# Altium schematic sheet 0189_POWER METER -PAC19.SchDoc
size A3
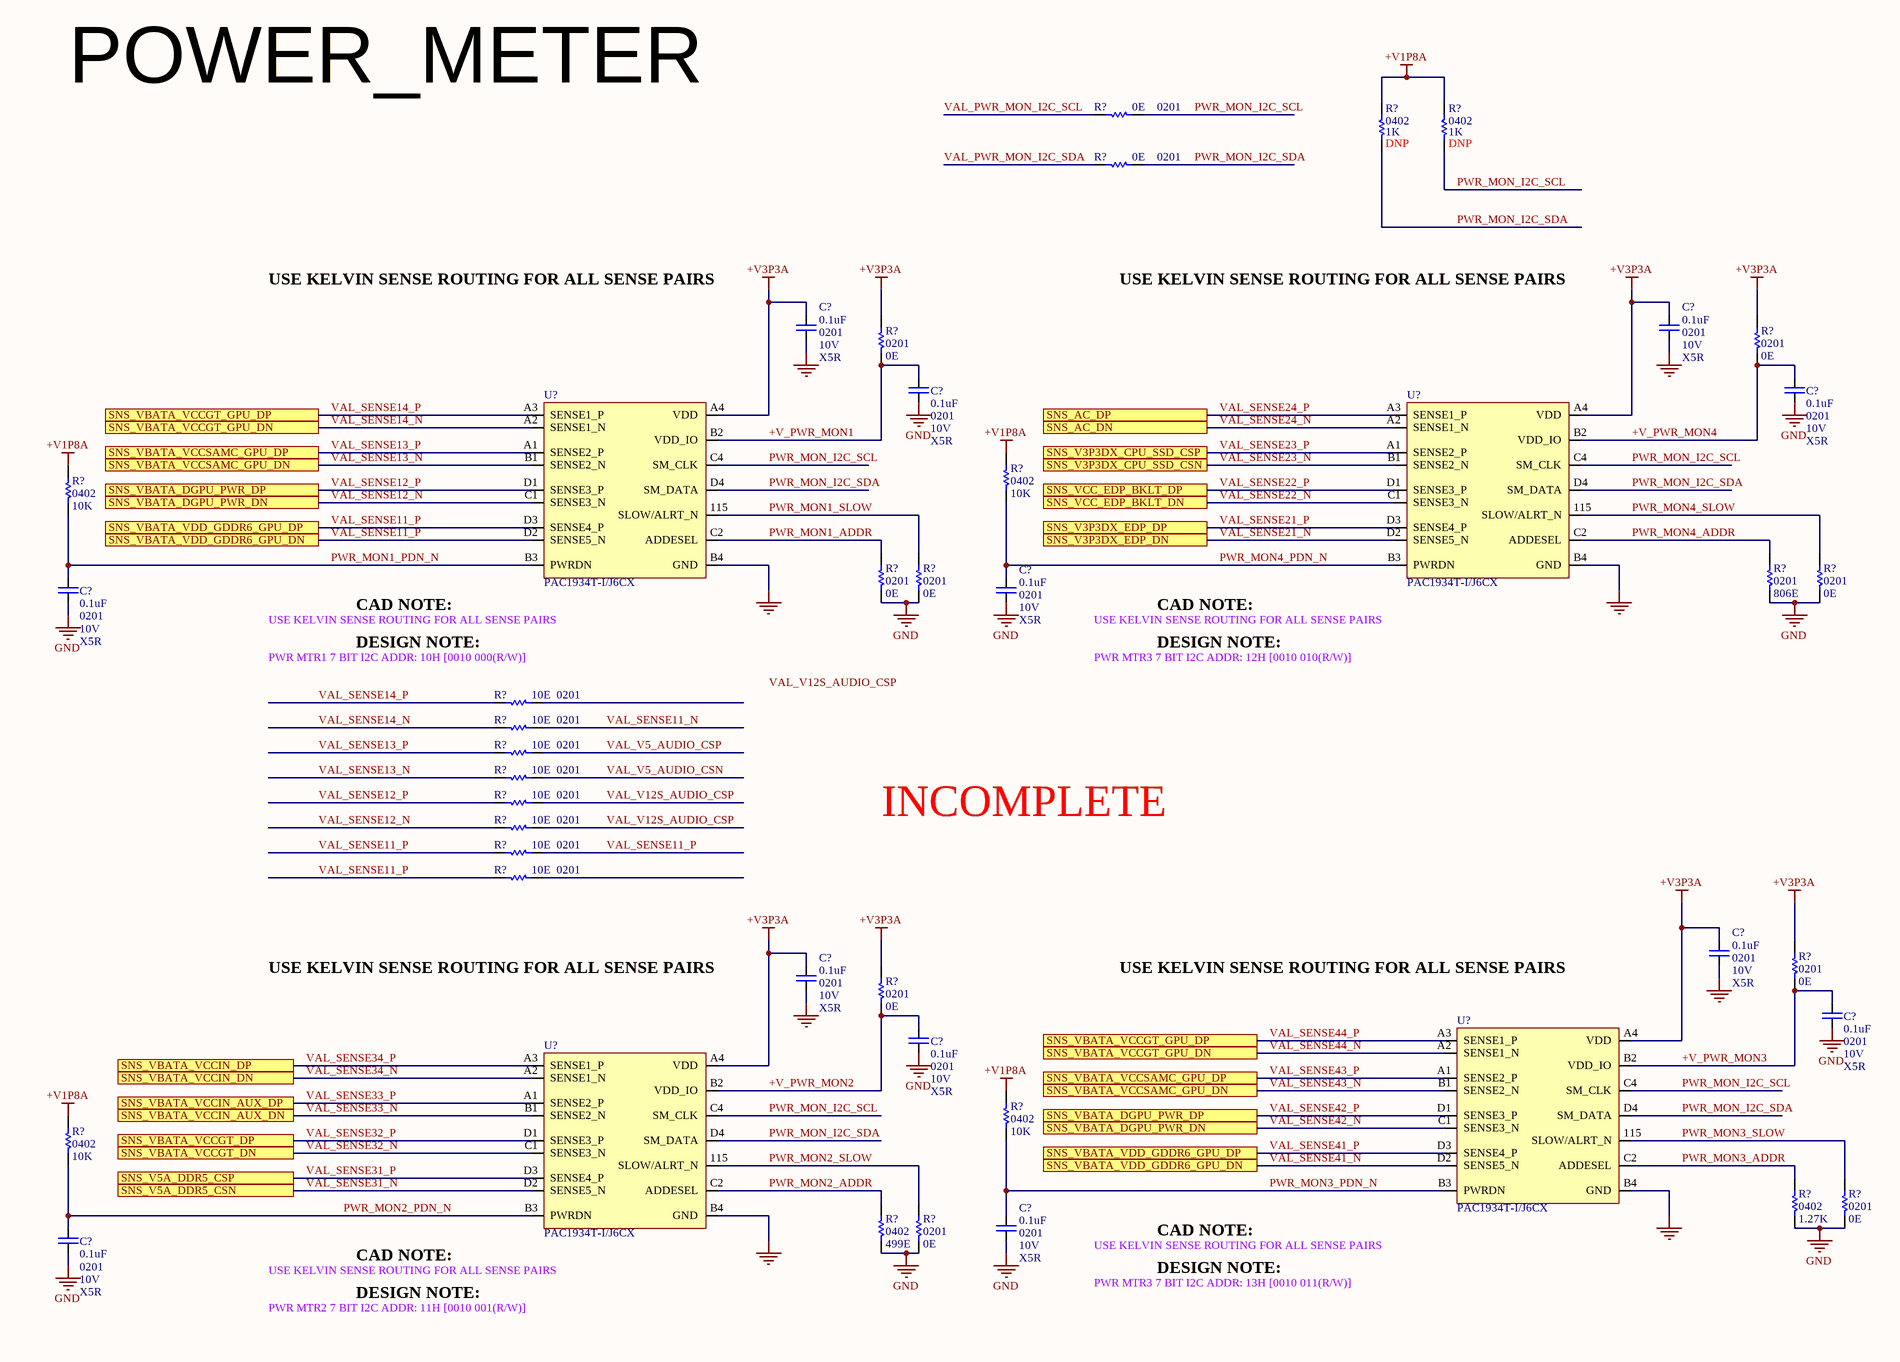
[diagram p0: 0189_POWER METER -PAC19.SchDoc, bottom left]

## Parts
(Parts that share a designator on the sheet are numbered #1, #2 ... from top to bottom, then left to right.)
C?#1  value 0.1uF  Case/Package: 0201  Voltage: 10V  Dielectric: X5R  [CAPC0201]
C?#2  value 0.1uF  Case/Package: 0201  Voltage: 10V  Dielectric: X5R  [CAPC0201]
C?#3  value 0.1uF  Case/Package: 0201  Voltage: 10V  Dielectric: X5R  [CAPC0201]
C?#4  value 0.1uF  Case/Package: 0201  Voltage: 10V  Dielectric: X5R  [CAPC0201]
C?#5  value 0.1uF  Case/Package: 0201  Voltage: 10V  Dielectric: X5R  [CAPC0201]
C?#6  value 0.1uF  Case/Package: 0201  Voltage: 10V  Dielectric: X5R  [CAPC0201]
C?#7  value 0.1uF  Case/Package: 0201  Voltage: 10V  Dielectric: X5R  [CAPC0201]
C?#8  value 0.1uF  Case/Package: 0201  Voltage: 10V  Dielectric: X5R  [CAPC0201]
C?#9  value 0.1uF  Case/Package: 0201  Voltage: 10V  Dielectric: X5R  [CAPC0201]
C?#10  value 0.1uF  Case/Package: 0201  Voltage: 10V  Dielectric: X5R  [CAPC0201]
C?#11  value 0.1uF  Case/Package: 0201  Voltage: 10V  Dielectric: X5R  [CAPC0201]
C?#12  value 0.1uF  Case/Package: 0201  Voltage: 10V  Dielectric: X5R  [CAPC0201]
R?#1  value 0E  Case/Package: 0201  [RESC0201]  (hidden comment: Res)
R?#2  value 1K  Case/Package: 0402  [RESC0402]  (hidden comment: Res)
R?#3  value 1K  Case/Package: 0402  [RESC0402]  (hidden comment: Res)
R?#4  value 0E  Case/Package: 0201  [RESC0201]  (hidden comment: Res)
R?#5  value 0E  Case/Package: 0201  [RESC0201]  (hidden comment: Res)
R?#6  value 0E  Case/Package: 0201  [RESC0201]  (hidden comment: Res)
R?#7  value 10K  Case/Package: 0402  [RESC0402]  (hidden comment: Res)
R?#8  value 10K  Case/Package: 0402  [RESC0402]  (hidden comment: Res)
R?#9  value 0E  Case/Package: 0201  [RESC0201]  (hidden comment: Res)
R?#10  value 0E  Case/Package: 0201  [RESC0201]  (hidden comment: Res)
R?#11  value 806E  Case/Package: 0201  [RESC0201]  (hidden comment: Res)
R?#12  value 0E  Case/Package: 0201  [RESC0201]  (hidden comment: Res)
R?#13  value 10E  Case/Package: 0201  [RESC0201]  (hidden comment: Res)
R?#14  value 10E  Case/Package: 0201  [RESC0201]  (hidden comment: Res)
R?#15  value 10E  Case/Package: 0201  [RESC0201]  (hidden comment: Res)
R?#16  value 10E  Case/Package: 0201  [RESC0201]  (hidden comment: Res)
R?#17  value 10E  Case/Package: 0201  [RESC0201]  (hidden comment: Res)
R?#18  value 10E  Case/Package: 0201  [RESC0201]  (hidden comment: Res)
R?#19  value 10E  Case/Package: 0201  [RESC0201]  (hidden comment: Res)
R?#20  value 10E  Case/Package: 0201  [RESC0201]  (hidden comment: Res)
R?#21  value 0E  Case/Package: 0201  [RESC0201]  (hidden comment: Res)
R?#22  value 0E  Case/Package: 0201  [RESC0201]  (hidden comment: Res)
R?#23  value 10K  Case/Package: 0402  [RESC0402]  (hidden comment: Res)
R?#24  value 10K  Case/Package: 0402  [RESC0402]  (hidden comment: Res)
R?#25  value 1.27K  Case/Package: 0402  [RESC0201]  (hidden comment: Res)
R?#26  value 0E  Case/Package: 0201  [RESC0201]  (hidden comment: Res)
R?#27  value 499E  Case/Package: 0402  [RESC0402]  (hidden comment: Res)
R?#28  value 0E  Case/Package: 0201  [RESC0201]  (hidden comment: Res)
U?#1  PAC1934T-I/J6CX
U?#2  PAC1934T-I/J6CX
U?#3  PAC1934T-I/J6CX
U?#4  PAC1934T-I/J6CX

## Ports
SNS_AC_DN, SNS_AC_DP, SNS_V3P3DX_CPU_SSD_CSN, SNS_V3P3DX_CPU_SSD_CSP, SNS_V3P3DX_EDP_DN, SNS_V3P3DX_EDP_DP, SNS_V5A_DDR5_CSN, SNS_V5A_DDR5_CSP, SNS_VBATA_DGPU_PWR_DN, SNS_VBATA_DGPU_PWR_DP, SNS_VBATA_VCCGT_DN, SNS_VBATA_VCCGT_DP, SNS_VBATA_VCCGT_GPU_DN, SNS_VBATA_VCCGT_GPU_DP, SNS_VBATA_VCCIN_AUX_DN, SNS_VBATA_VCCIN_AUX_DP, SNS_VBATA_VCCIN_DN, SNS_VBATA_VCCIN_DP, SNS_VBATA_VCCSAMC_GPU_DN, SNS_VBATA_VCCSAMC_GPU_DP, SNS_VBATA_VDD_GDDR6_GPU_DN, SNS_VBATA_VDD_GDDR6_GPU_DP, SNS_VCC_EDP_BKLT_DN, SNS_VCC_EDP_BKLT_DP

## Nets
+V1P8A: R?#2.1 R?#3.1 R?#7.1 R?#8.1 R?#23.1 R?#24.1
+V3P3A: C?#1.2 C?#2.2 C?#7.2 C?#8.2 R?#5.1 R?#6.1 R?#21.1 R?#22.1 U?#1.A4(VDD) U?#2.A4(VDD) U?#3.A4(VDD) U?#4.A4(VDD)
GND: C?#1.1 C?#2.1 C?#3.1 C?#4.1 C?#5.1 C?#6.1 C?#7.1 C?#8.1 C?#9.1 C?#10.1 C?#11.1 C?#12.1 R?#9.2 R?#10.2 R?#11.2 R?#12.2 R?#25.2 R?#26.2 R?#27.2 R?#28.2 U?#1.B4(GND) U?#2.B4(GND) U?#3.B4(GND) U?#4.B4(GND)
+V_PWR_MON1: C?#3.2 R?#5.2 U?#1.B2(VDD_IO)
+V_PWR_MON2: C?#10.2 R?#22.2 U?#4.B2(VDD_IO)
+V_PWR_MON3: C?#9.2 R?#21.2 U?#3.B2(VDD_IO)
+V_PWR_MON4: C?#4.2 R?#6.2 U?#2.B2(VDD_IO)
PWR_MON1_ADDR: R?#9.1 U?#1.C2(ADDESEL)
PWR_MON1_PDN_N: C?#5.2 R?#8.2 U?#1.B3(PWRDN)
PWR_MON1_SLOW: R?#10.1 U?#1.115(SLOW/ALRT_N)
PWR_MON2_ADDR: R?#27.1 U?#4.C2(ADDESEL)
PWR_MON2_PDN_N: C?#12.2 R?#24.2 U?#4.B3(PWRDN)
PWR_MON2_SLOW: R?#28.1 U?#4.115(SLOW/ALRT_N)
PWR_MON3_ADDR: R?#25.1 U?#3.C2(ADDESEL)
PWR_MON3_PDN_N: C?#11.2 R?#23.2 U?#3.B3(PWRDN)
PWR_MON3_SLOW: R?#26.1 U?#3.115(SLOW/ALRT_N)
PWR_MON4_ADDR: R?#11.1 U?#2.C2(ADDESEL)
PWR_MON4_PDN_N: C?#6.2 R?#7.2 U?#2.B3(PWRDN)
PWR_MON4_SLOW: R?#12.1 U?#2.115(SLOW/ALRT_N)
PWR_MON_I2C_SCL: R?#1.2 R?#3.2 U?#1.C4(SM_CLK) U?#2.C4(SM_CLK) U?#3.C4(SM_CLK) U?#4.C4(SM_CLK)
PWR_MON_I2C_SDA: R?#2.2 R?#4.2 U?#1.D4(SM_DATA) U?#2.D4(SM_DATA) U?#3.D4(SM_DATA) U?#4.D4(SM_DATA)
VAL_PWR_MON_I2C_SCL: R?#1.1
VAL_PWR_MON_I2C_SDA: R?#4.1
VAL_SENSE11_N: R?#14.2
VAL_SENSE11_P: R?#19.1 R?#19.2 R?#20.1 U?#1.D2(SENSE5_N) U?#1.D3(SENSE4_P) U?#3.D2(SENSE5_N) U?#3.D3(SENSE4_P) ; port SNS_VBATA_VDD_GDDR6_GPU_DP, port SNS_VBATA_VDD_GDDR6_GPU_DN  [also labelled VAL_SENSE41_N, VAL_SENSE41_P]
VAL_SENSE12_N: R?#18.1 U?#1.C1(SENSE3_N) U?#3.C1(SENSE3_N) ; port SNS_VBATA_DGPU_PWR_DN  [also labelled VAL_SENSE42_N]
VAL_SENSE12_P: R?#17.1 U?#1.D1(SENSE3_P) U?#3.D1(SENSE3_P) ; port SNS_VBATA_DGPU_PWR_DP  [also labelled VAL_SENSE42_P]
VAL_SENSE13_N: R?#16.1 U?#1.B1(SENSE2_N) U?#3.B1(SENSE2_N) ; port SNS_VBATA_VCCSAMC_GPU_DN  [also labelled VAL_SENSE43_N]
VAL_SENSE13_P: R?#15.1 U?#1.A1(SENSE2_P) U?#3.A1(SENSE2_P) ; port SNS_VBATA_VCCSAMC_GPU_DP  [also labelled VAL_SENSE43_P]
VAL_SENSE14_N: R?#14.1 U?#1.A2(SENSE1_N) U?#3.A2(SENSE1_N) ; port SNS_VBATA_VCCGT_GPU_DN  [also labelled VAL_SENSE44_N]
VAL_SENSE14_P: R?#13.1 U?#1.A3(SENSE1_P) U?#3.A3(SENSE1_P) ; port SNS_VBATA_VCCGT_GPU_DP  [also labelled VAL_SENSE44_P]
VAL_SENSE21_N: U?#2.D2(SENSE5_N) ; port SNS_V3P3DX_EDP_DN
VAL_SENSE21_P: U?#2.D3(SENSE4_P) ; port SNS_V3P3DX_EDP_DP
VAL_SENSE22_N: U?#2.C1(SENSE3_N) ; port SNS_VCC_EDP_BKLT_DN
VAL_SENSE22_P: U?#2.D1(SENSE3_P) ; port SNS_VCC_EDP_BKLT_DP
VAL_SENSE23_N: U?#2.B1(SENSE2_N) ; port SNS_V3P3DX_CPU_SSD_CSN
VAL_SENSE23_P: U?#2.A1(SENSE2_P) ; port SNS_V3P3DX_CPU_SSD_CSP
VAL_SENSE24_N: U?#2.A2(SENSE1_N) ; port SNS_AC_DN
VAL_SENSE24_P: U?#2.A3(SENSE1_P) ; port SNS_AC_DP
VAL_SENSE31_N: U?#4.D2(SENSE5_N) ; port SNS_V5A_DDR5_CSN
VAL_SENSE31_P: U?#4.D3(SENSE4_P) ; port SNS_V5A_DDR5_CSP
VAL_SENSE32_N: U?#4.C1(SENSE3_N) ; port SNS_VBATA_VCCGT_DN
VAL_SENSE32_P: U?#4.D1(SENSE3_P) ; port SNS_VBATA_VCCGT_DP
VAL_SENSE33_N: U?#4.B1(SENSE2_N) ; port SNS_VBATA_VCCIN_AUX_DN
VAL_SENSE33_P: U?#4.A1(SENSE2_P) ; port SNS_VBATA_VCCIN_AUX_DP
VAL_SENSE34_N: U?#4.A2(SENSE1_N) ; port SNS_VBATA_VCCIN_DN
VAL_SENSE34_P: U?#4.A3(SENSE1_P) ; port SNS_VBATA_VCCIN_DP
VAL_V5_AUDIO_CSN: R?#16.2
VAL_V5_AUDIO_CSP: R?#15.2
VAL_V12S_AUDIO_CSP: R?#17.2 R?#18.2

Not connected (* = marked no-connect by the designer): R?#13 2; R?#20 2

## Notes on the sheet
- POWER_METER
- USE KELVIN SENSE ROUTING FOR ALL SENSE PAIRS
- CAD NOTE:
- (near R?#13) PWR MTR1 7 BIT I2C ADDR: 10H [0010 000(R/W)]
- DESIGN NOTE:
- PWR MTR3 7 BIT I2C ADDR: 12H [0010 010(R/W)]
- INCOMPLETE
- PWR MTR2 7 BIT I2C ADDR: 11H [0010 001(R/W)]
- PWR MTR3 7 BIT I2C ADDR: 13H [0010 011(R/W)]
- Labels drawn without touching a wire or pin: VAL_V12S_AUDIO_CSP

## Library data of the parts
C?#1-C?#12 = Cap: CAP CER 0.1uF 10V X5R 0201
R?#1 R?#4-R?#6 R?#9-R?#12 R?#21 R?#22 R?#26 R?#28 = Res: Thick Film Resistor -  0ohm, 1%, 0201
R?#2 R?#3 = Res: Thick Film Resistor -  1Kohm, 1%, 0402; DNP: DNP
R?#7 R?#8 R?#23 R?#24 = Res: Thick Film Resistor -  10Kohm, 1%, 0402
R?#13-R?#20 = Res: Thick Film Resistor -  10ohm, 1%, 0201
R?#25 = Res: Thick Film Resistor -  0ohm, 1%, 0402
R?#27 = Res: Thick Film Resistor -  499ohm, 1%, 0402